# Altium schematic sheet 10 header.SchDoc
size A4; SheetNumber: 13; SheetTotal: 13
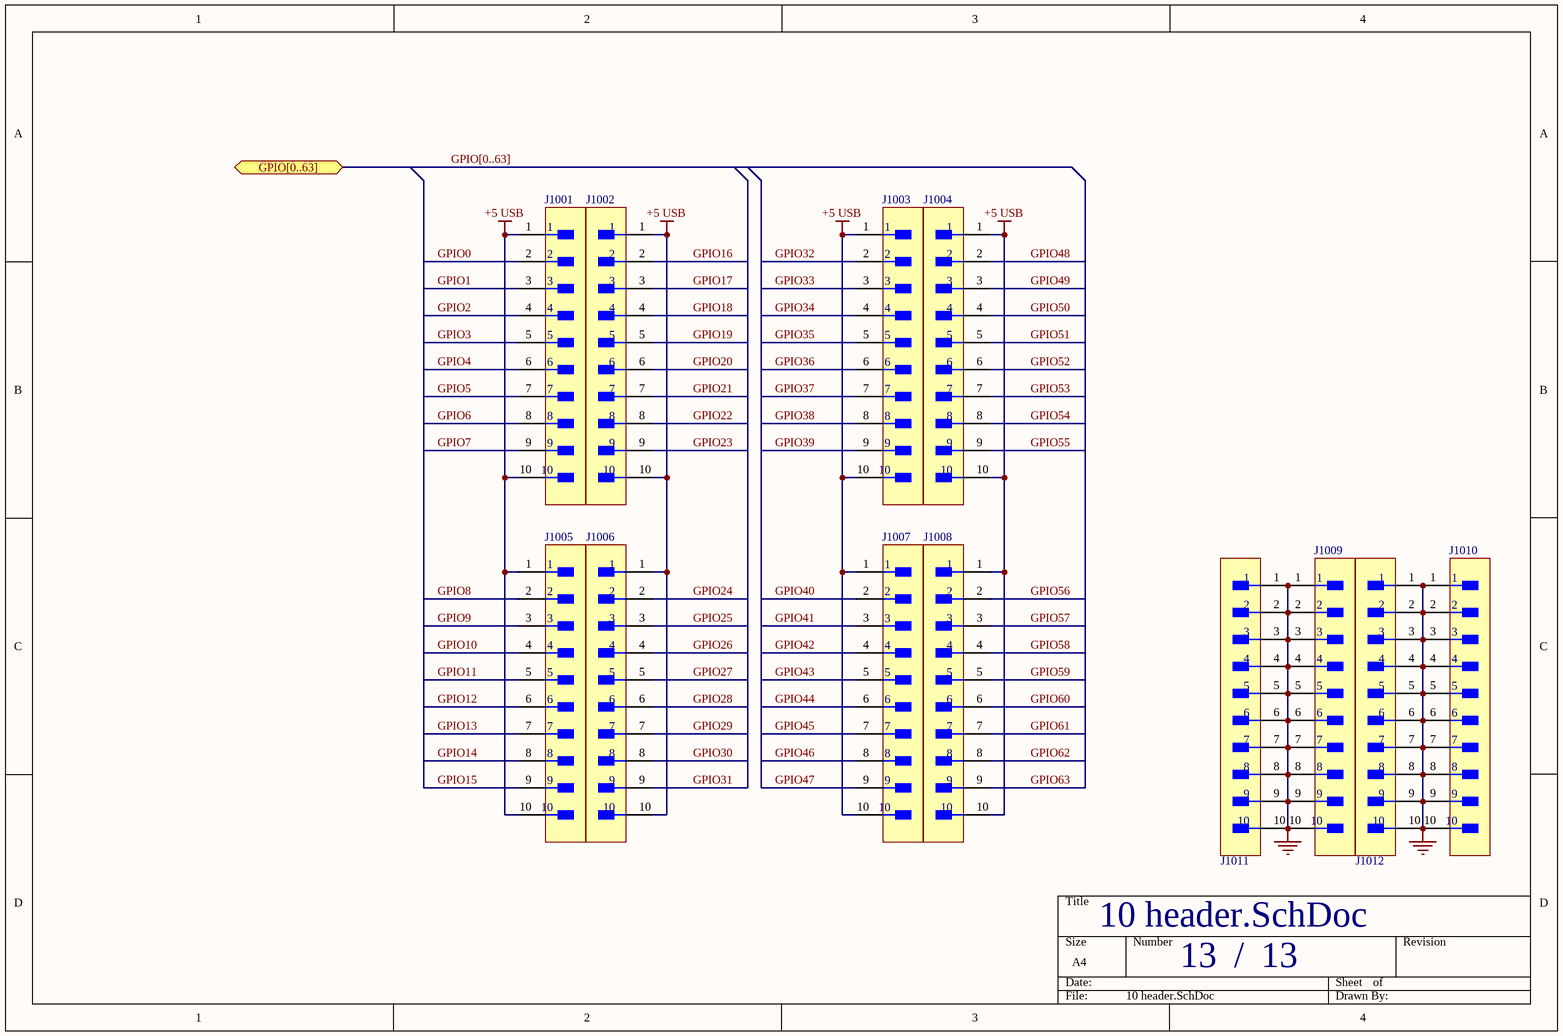
[diagram p0: 10 header.SchDoc]

## Parts
J1001  TSW-110-07-T-S  [FP-TSW-110-07-T-S-MFG]  (value not drawn)
J1002  TSW-110-07-T-S  [FP-TSW-110-07-T-S-MFG]  (value not drawn)
J1003  TSW-110-07-T-S  [FP-TSW-110-07-T-S-MFG]  (value not drawn)
J1004  TSW-110-07-T-S  [FP-TSW-110-07-T-S-MFG]  (value not drawn)
J1005  TSW-110-07-T-S  [FP-TSW-110-07-T-S-MFG]  (value not drawn)
J1006  TSW-110-07-T-S  [FP-TSW-110-07-T-S-MFG]  (value not drawn)
J1007  TSW-110-07-T-S  [FP-TSW-110-07-T-S-MFG]  (value not drawn)
J1008  TSW-110-07-T-S  [FP-TSW-110-07-T-S-MFG]  (value not drawn)
J1009  TSW-110-07-T-S  [FP-TSW-110-07-T-S-MFG]  (value not drawn)
J1010  TSW-110-07-T-S  [FP-TSW-110-07-T-S-MFG]  (value not drawn)
J1011  TSW-110-07-T-S  [FP-TSW-110-07-T-S-MFG]  (value not drawn)
J1012  TSW-110-07-T-S  [FP-TSW-110-07-T-S-MFG]  (value not drawn)

## Ports
GPIO[0..63] (bidir)

## Nets
+5 USB: J1001.1 J1001.10 J1002.1 J1002.10 J1003.1 J1003.10 J1004.1 J1004.10 J1005.1 J1005.10 J1006.1 J1006.10 J1007.1 J1007.10 J1008.1 J1008.10
GND: J1009.1 J1009.2 J1009.3 J1009.4 J1009.5 J1009.6 J1009.7 J1009.8 J1009.9 J1009.10 J1010.1 J1010.2 J1010.3 J1010.4 J1010.5 J1010.6 J1010.7 J1010.8 J1010.9 J1010.10 J1011.1 J1011.2 J1011.3 J1011.4 J1011.5 J1011.6 J1011.7 J1011.8 J1011.9 J1011.10 J1012.1 J1012.2 J1012.3 J1012.4 J1012.5 J1012.6 J1012.7 J1012.8 J1012.9 J1012.10
GPIO0: J1001.2
GPIO1: J1001.3
GPIO2: J1001.4
GPIO3: J1001.5
GPIO4: J1001.6
GPIO5: J1001.7
GPIO6: J1001.8
GPIO7: J1001.9
GPIO8: J1005.2
GPIO9: J1005.3
GPIO10: J1005.4
GPIO11: J1005.5
GPIO12: J1005.6
GPIO13: J1005.7
GPIO14: J1005.8
GPIO15: J1005.9
GPIO16: J1002.2
GPIO17: J1002.3
GPIO18: J1002.4
GPIO19: J1002.5
GPIO20: J1002.6
GPIO21: J1002.7
GPIO22: J1002.8
GPIO23: J1002.9
GPIO24: J1006.2
GPIO25: J1006.3
GPIO26: J1006.4
GPIO27: J1006.5
GPIO28: J1006.6
GPIO29: J1006.7
GPIO30: J1006.8
GPIO31: J1006.9
GPIO32: J1003.2
GPIO33: J1003.3
GPIO34: J1003.4
GPIO35: J1003.5
GPIO36: J1003.6
GPIO37: J1003.7
GPIO38: J1003.8
GPIO39: J1003.9
GPIO40: J1007.2
GPIO41: J1007.3
GPIO42: J1007.4
GPIO43: J1007.5
GPIO44: J1007.6
GPIO45: J1007.7
GPIO46: J1007.8
GPIO47: J1007.9
GPIO48: J1004.2
GPIO49: J1004.3
GPIO50: J1004.4
GPIO51: J1004.5
GPIO52: J1004.6
GPIO53: J1004.7
GPIO54: J1004.8
GPIO55: J1004.9
GPIO56: J1008.2
GPIO57: J1008.3
GPIO58: J1008.4
GPIO59: J1008.5
GPIO60: J1008.6
GPIO61: J1008.7
GPIO62: J1008.8
GPIO63: J1008.9

## Buses and harness runs
bus GPIO[0..63] = port GPIO[0..63]

## Notes on the sheet
- /

## Library data of the parts
J1001-J1012 = CMP-00575-00272505-1: TSW-110-07-T-S TSW - Samtec 2.54mm Pin Header 10.92mm Overall Pin Length (07) (mcv)(TO22); Manufacturer Lifecycle Status: PRODUCTION; Connector Type: Male Pin; Number of Positions: 10; Max Current Rating: 7.6A; Gender: Male; Max Voltage Rating (AC): 550V; Max Operating Temperature: 105°C; Packaging: Bulk; Lead Free: Lead Free; Min Operating Temperature: -55°C; Width: 2.54mm; RoHS: Compliant; Depth: 2.54mm; Lifecycle Status: Production; REACH SVHC: No SVHC; Height: 8.71mm; Number of Rows: 1; Housing Material: Polyester; Orientation: Straight; Radiation Hardening: No; Number of Contacts: 10; Housing Color: Black; Mount: Through Hole; Lead Pitch: 2.54mm; Termination: Solder; Color: Black; Contact Material: Nickel, Tin; Number of Pins: 10; Length: 25.4mm; Pitch: 2.54mm; Contact Plating: Tin; Contact Mating Length: 5.842mm